# EAGLE design tinypico_sensor_board (EAGLE 9.6.2)
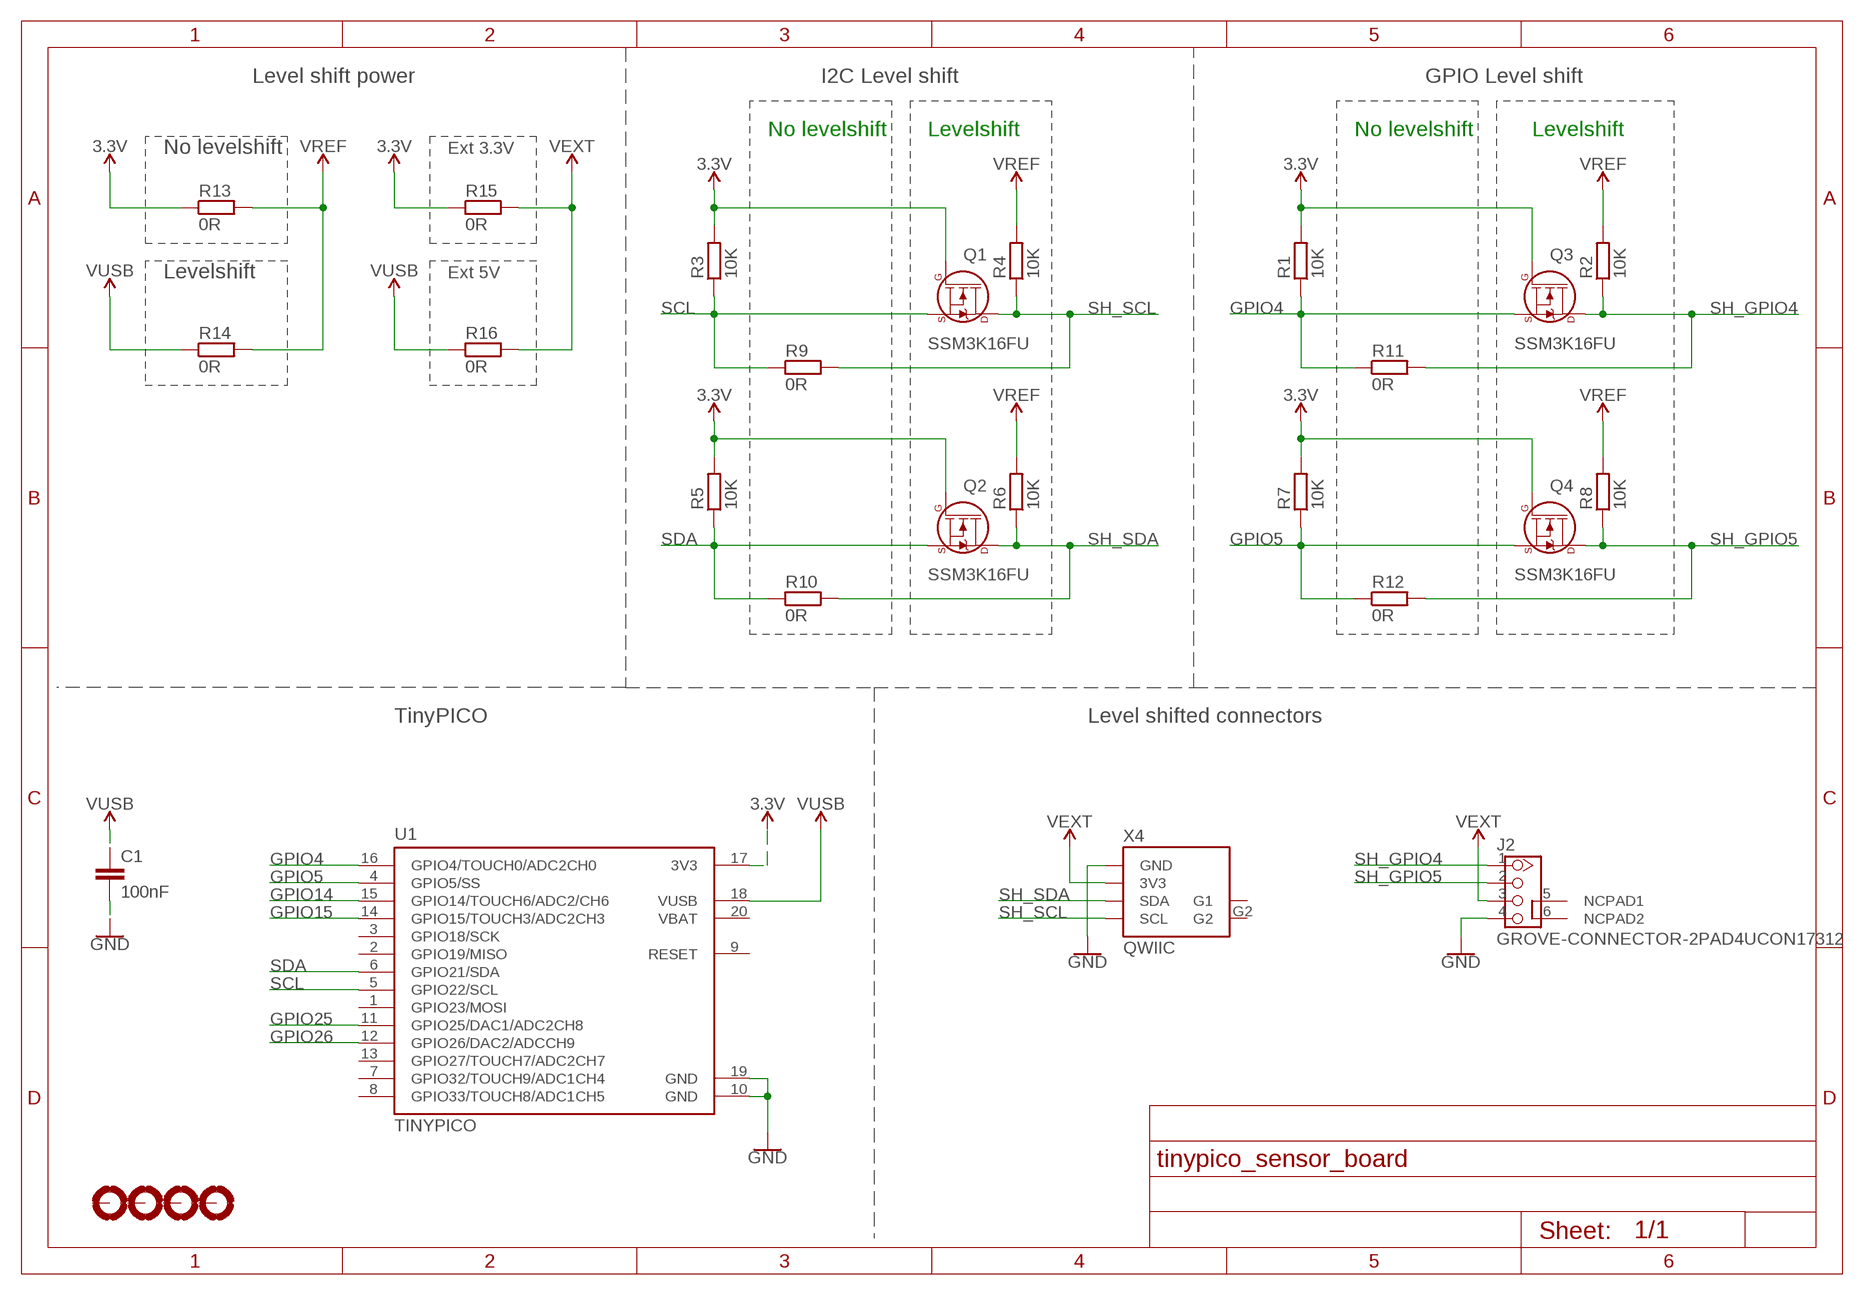
[diagram p0: schematic, sheet 1]

## Parts
C1  100nF  CAPC0603  [C0603]
H1  MOUNTHOLE-PAD3.2  [3.2-PAD]
H2  MOUNTHOLE-PAD3.2  [3.2-PAD]
H3  MOUNTHOLE-PAD3.2  [3.2-PAD]
H4  MOUNTHOLE-PAD3.2  [3.2-PAD]
J2  GROVE-CONNECTOR-2PAD4UCON17312  [4UCON17312]
Q1  SSM3K16FU  MOSFET-NCHSOT323  [SOT323]
Q2  SSM3K16FU  MOSFET-NCHSOT323  [SOT323]
Q3  SSM3K16FU  MOSFET-NCHSOT323  [SOT323]
Q4  SSM3K16FU  MOSFET-NCHSOT323  [SOT323]
R1  10K  RESISTOR0603  [R0603]
R2  10K  RESISTOR0603  [R0603]
R3  10K  RESISTOR0603  [R0603]
R4  10K  RESISTOR0603  [R0603]
R5  10K  RESISTOR0603  [R0603]
R6  10K  RESISTOR0603  [R0603]
R7  10K  RESISTOR0603  [R0603]
R8  10K  RESISTOR0603  [R0603]
R9  0R  RESISTOR0603  [R0603]
R10  0R  RESISTOR0603  [R0603]
R11  0R  RESISTOR0603  [R0603]
R12  0R  RESISTOR0603  [R0603]
R13  0R  RESISTOR1206  [R1206]
R14  0R  RESISTOR1206  [R1206]
R15  0R  RESISTOR1206  [R1206]
R16  0R  RESISTOR1206  [R1206]
U1  TINYPICO  [TINYPICO]
X4  QWIIC  QWIICRA  [JST-SH-4-SMD-RA]

## Nets
3.3V: Q1.1(G) Q2.1(G) Q3.1(G) Q4.1(G) R1.2 R3.2 R5.2 R7.2 R13.1 R15.1 U1.17(3V3)
GND: C1.2 J2.4(GND) U1.10(GND) U1.19(GND) X4.GND
GPIO4: Q3.2(S) R1.1 R11.1 U1.16(GPIO4/TOUCH0/ADC2CH0)
GPIO5: Q4.2(S) R7.1 R12.1 U1.4(GPIO5/SS)
GPIO14: U1.15(GPIO14/TOUCH6/ADC2/CH6)
GPIO15: U1.14(GPIO15/TOUCH3/ADC2CH3)
GPIO25: U1.11(GPIO25/DAC1/ADC2CH8)
GPIO26: U1.12(GPIO26/DAC2/ADCCH9)
SCL: Q1.2(S) R3.1 R9.1 U1.5(GPIO22/SCL)
SDA: Q2.2(S) R5.1 R10.1 U1.6(GPIO21/SDA)
SH_GPIO4: J2.1(SCL) Q3.3(D) R2.1 R11.2
SH_GPIO5: J2.2(SDA) Q4.3(D) R8.1 R12.2
SH_SCL: Q1.3(D) R4.1 R9.2 X4.SCL
SH_SDA: Q2.3(D) R6.1 R10.2 X4.SDA
VEXT: J2.3(VCC) R15.2 R16.2 X4.3V3
VREF: R2.2 R4.2 R6.2 R8.2 R13.2 R14.2
VUSB: C1.1 R14.1 R16.1 U1.18(VUSB)
Unconnected: H1.B3,2(MOUNT) H2.B3,2(MOUNT) H3.B3,2(MOUNT) H4.B3,2(MOUNT) J2.5(NCPAD1) J2.6(NCPAD2) U1.1(GPIO23/MOSI) U1.2(GPIO19/MISO) U1.3(GPIO18/SCK) U1.7(GPIO32/TOUCH9/ADC1CH4) U1.8(GPIO33/TOUCH8/ADC1CH5) U1.9(RESET) U1.13(GPIO27/TOUCH7/ADC2CH7) U1.20(VBAT) X4.G1 X4.G2

## Notes on the sheet
- Level shift power | I2C Level shift | GPIO Level shift
- No levelshift | Levelshift | No levelshift | Levelshift
- No levelshift | Ext 3.3V
- Levelshift | Ext 5V
- TinyPICO | Level shifted connectors

## Library data of the parts
C1 = M2M-Passives:CAP
H1-H4 = M2M-Holes:MOUNTHOLE-PAD
J2 = M2M-Connectors:GROVE-CONNECTOR-2PAD
Q1-Q4 = M2M-DiscreteSemi:MOSFET-NCH
R1-R16 = M2M-Passives:RESISTOR
U1 = M2M-Modules:TINYPICO
X4 = M2M-Connectors:QWIIC

## Board
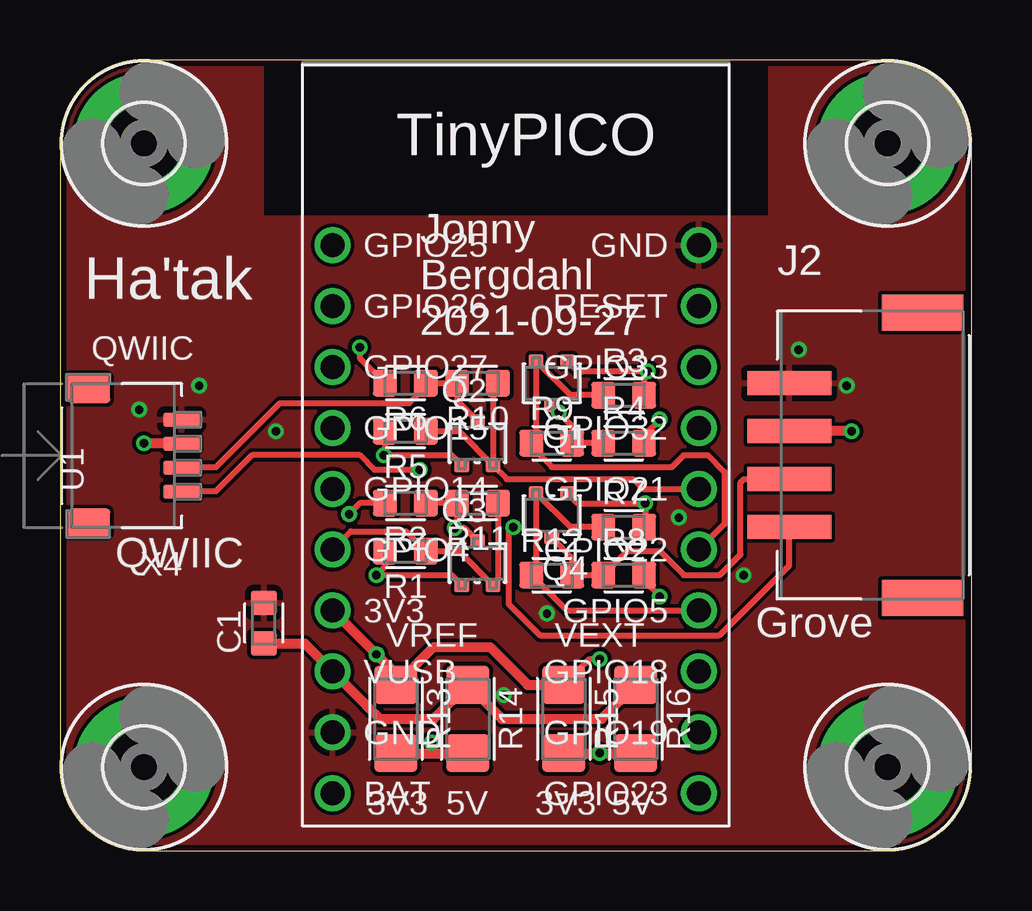
[diagram p1: board, top side]
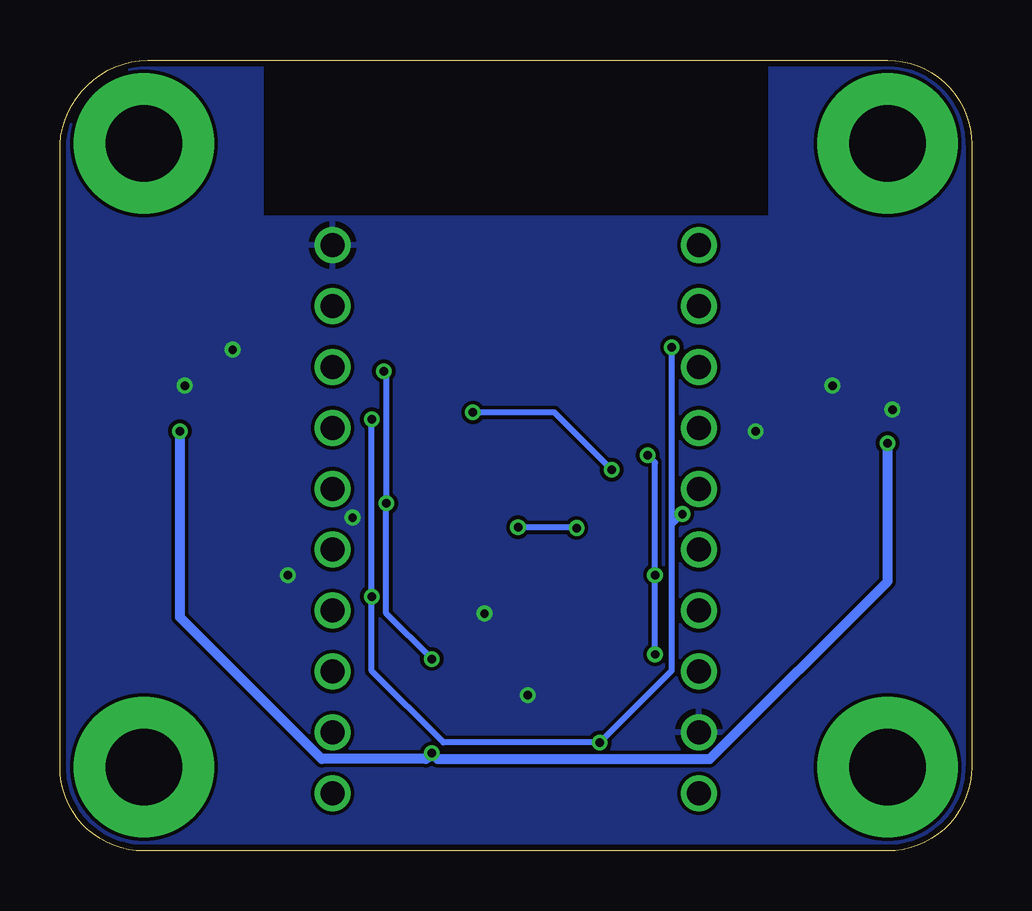
[diagram p2: board, bottom side, seen from below]

Size 38 x 32.98 mm. Coordinates in mm from the lower left corner, seen from the top.
Outline: 0,29.47 0,3.5 arc90 3.5,0 34.5,0 arc90 38,3.5 38,29.47 arc90 34,32.97 3.5,32.97 arc90 0,29.47
Copper layers (1*16): Top 0.035mm / dielectric 1.5mm / Bottom 0.035mm
Design rules "SeeedStudio_2layer_DRU_no_angle_20140221": minimum track width 6mil, minimum drill 0.3mm, track to track 6mil, track to pad 6mil, pad to pad 6mil, via to via 6mil, smd to smd 0mil, copper to edge 10mil, drill to drill 10mil, minimum pad ring 2mil, minimum via ring 6mil, stop-mask expansion 2mil, vias tented up to drill 1000mil, thermal gap 10mil

### Footprints (pad centres in the part's own frame; a part is rotated, then mirrored left to right if it is on the bottom)
C0603 = smd 1 x 1.1: 1 -0.85,0; 2 0.85,0
3.2-PAD = drill 3.2 pad 5.842: B3,2 0,0
4UCON17312 = smd 1 x 3.5: 1 3,0; 2 1,0; 3 -1,0; 4 -3,0 | smd 1.5 x 3.4: 5 -5.95,5.55; 6 5.95,5.55
SOT323 = smd 0.6 x 0.55: 1 -0.65,-0.925; 2 0.65,-0.925; 3 0,0.925
R0603 = smd 1 x 1.1: 1 -0.85,0; 2 0.85,0
R1206 = smd 1.6 x 1.803: 1 -1.422,0; 2 1.422,0
TINYPICO = drill 1: 1 -12.598,-7.633; 2 -10.058,-7.633; 3 -7.518,-7.633; 4 -4.978,-7.633; 5 -2.438,-7.633; 6 0.102,-7.633; 7 2.642,-7.633; 8 5.182,-7.633; 9 7.722,-7.633; 10 10.262,-7.633; 11 10.262,7.633; 12 7.722,7.633; 13 5.182,7.633; 14 2.642,7.633; 15 0.102,7.633; 16 -2.438,7.633; 17 -4.978,7.633; 18 -7.518,7.633; 19 -10.058,7.633; 20 -12.598,7.633
JST-SH-4-SMD-RA = smd 0.6 x 1.55: 3V3 0.5,-2; GND 1.5,-2; SCL -1.5,-2; SDA -0.5,-2 | smd 1.2 x 1.8: G1 2.8,1.875; G2 -2.8,1.875

### Placement (x,y rotation side)
C1  8.5,9.5 90 top
H1  34.5,29.5 0 top
H2  3.5,29.5 0 top
H3  34.5,3.5 0 top
H4  3.5,3.5 0 top
J2  30.4,16.5 270 top
Q1  20.5,19.5 180 top
Q2  17.4,17 0 top
Q3  17.4,12 0 top
Q4  20.5,14 180 top
R1  14.4,12.5 180 top
R2  14.4,14.5 180 top
R3  23.5,19 0 top
R4  23.5,17 0 top
R5  14.4,17.5 180 top
R6  14.4,19.5 180 top
R7  23.5,13.5 0 top
R8  23.5,11.5 0 top
R9  20.5,17 0 top
R10  17.4,19.5 180 top
R11  17.4,14.5 180 top
R12  20.5,11.5 0 top
R13  14,5.5 270 top
R14  17,5.5 270 top
R15  21,5.5 270 top
R16  24,5.5 270 top
U1  19,15 90 top
X4  3.08,16.48 90 top

### Tracks (layer width: path | path; a pad name or v marks a point on that pad's centre or on a via)
3.3V  (via drill 0.35)
  Top 0.254: R5.2 13.55,16.55 v13.5,16.5 16.32,16.5 Q2.1 | R1.2 13.55,11.86 v13.19,11.5 16.32,11.5 Q3.1 | R15.1 22.08,8 v22.5,8 | R3.2 24.35,19.85 v24.5,20 21.57,20 Q1.1 | R7.2 24.4,13.55 v24.4,14.49 21.58,14.49 Q4.1
  Top 0.406: U1.17 v13.19,8.19 14,7.39 R13.1 15.58,8.5 17.92,8.5 19.5,6.92 R15.1
  Bottom 0.254: v13.19,8.19 v13.19,11.5 13.19,16.19 v13.5,16.5 | v22.5,8 24.4,9.9 v24.4,14.49 24.4,19.9 v24.5,20
GND  (via drill 0.35)
  other vias: 9,17.5 18.5,6.5 28.5,11.5 25.8,13.9 20.3,9.9 32.8,19.4 30.8,20.9 3.3,18.4 5.8,19.4
  pour Top (rank 2): 0,0 0,33 38,33 38,0
  pour Bottom: 0,0 0,33 38,33 38,0
GPIO4
  Top 0.254: R11.1 18.25,11.28 Q3.2 16.62,12.5 R1.1 14.42,13.33 12.13,13.33 U1.16
GPIO5
  Top 0.254: R7.1 21.27,13.5 Q4.2 19.85,11.7 R12.1 21.15,10 26.61,10 U1.4
SCL
  Top 0.254: R3.1 21.27,19 Q1.2 19.85,17.2 | R9.1 19.85,17.2 | 19.85,17.2 19.85,16.65 20.5,16 25.5,16 26,16.5 27,16.5 27.7,15.8 27.7,13.63 U1.5
SDA
  Top 0.254: R5.1 16.62,17.5 Q2.2 | Q2.2 18.62,15.5 23.9,15.5 24.3,15.1 U1.6 | R10.1 18.05,19.3 Q2.2
SH_GPIO4  (via drill 0.35)
  Top 0.254: Q3.3 16.86,13.46 v16.46,13.46 16.55,13.55 R11.2 R2.1 | v18.9,13.5 18.7,13.3 18.7,10.3 20.01,8.99 27.49,8.99 30.4,11.9 J2.1
  Bottom 0.254: v16.46,13.46 16.5,13.5 v18.9,13.5
SH_GPIO5
  Top 0.254: Q4.3 21.35,12.22 R12.2 R8.1 23.65,12.5 25,12.5 26,11.5 27.5,11.5 28.37,12.37 28.37,15.37 28.5,15.5 J2.2
SH_SCL  (via drill 0.35)
  Top 0.254: R4.1 R9.2 21.35,17.73 v20.79,18.29 Q1.3 | X4.SCL 5.1,15 6.5,15 8,16.5 12.5,16.5 13.11,15.89 v15,15.89
  Bottom 0.254: v15,15.89 17.39,18.29 v20.79,18.29
SH_SDA
  Top 0.254: Q2.3 16.55,18.77 R10.2 R6.1 15.25,19.35 14.57,18.67 12.61,18.67 | X4.SDA 5.1,16 6.5,16 9.17,18.67 12.61,18.67 | 12.61,18.67
VEXT  (via drill 0.35)
  Top 0.406: R15.2 v22.5,4.08 R16.2 | v3.5,17 5.06,17 X4.3V3 | v33,17.5 J2.3
  Bottom 0.406: v3.5,17 3.5,11.24 10.91,3.84 22.26,3.84 v22.5,4.08 22.74,3.84 27.09,3.84 33,9.74 v33,17.5
VREF  (via drill 0.35)
  Top 0.254: 15.5,4.08 v15.5,4.52 | R6.2 12.5,20.55 v12.5,21 | v25,18 24.35,17.34 R4.2 | R8.2 24.35,11.26 v25,10.61 | R2.2 12.51,14.5 v12.05,14.05
  Top 0.406: R13.2 15.5,4.08 R14.2
  Bottom 0.254: v12.5,21 12.5,13.6 | 12.5,13.6 12.5,7.52 v15.5,4.52 22.02,4.52 25,7.5 v25,10.61 v25,18 | v12.05,14.05 12.5,13.6
VUSB
  Top 0.406: R16.1 22.58,5.5 18.42,5.5 R14.1 15.58,5.5 13.34,5.5 12.74,6.09 12.74,6.11 U1.18 10.2,8.65 C1.1

### Text on the board
tPlace: TinyPICO | Ha'tak | Jonny / Bergdahl / 2021-09-27 | QWIIC | Grove | VREF | VEXT | 3V3 | 5V | 3V3 | 5V
Opt3V3-3V3: VREF 3V3 - VEXT 3V3
Opt3V3-5V: VREF 3V3 - VEXT 5V
Opt5V_5V: VREF 5V - VEXT 5V